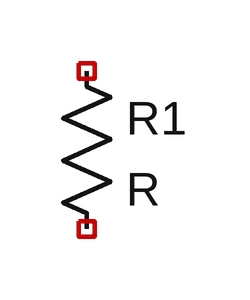
[diagram p0: schematic testSchematic.asc]
testSchematic.asc, the LTspice schematic file:
Version 4
SHEET 1 880 680
SYMBOL res 144 96 R0
SYMATTR InstName R1

The netlist it stands for:
* testSchematic.asc
R1 NC_01 NC_02 R
.backanno
.end